# EasyEDA Pro project ProPrj_STC电磁2.0挖孔.epro, schematic Schematic1

## Sheets
1 P1: Board Name: Board1; Create Date: 2025-11-08; Page Name: P1; Project Name: 电磁定制——陈; Schematic Name: Schematic1; Update Date: 2025-11-08; Company: 嘉立创EDA; Page Size: A4; Version: V1.0
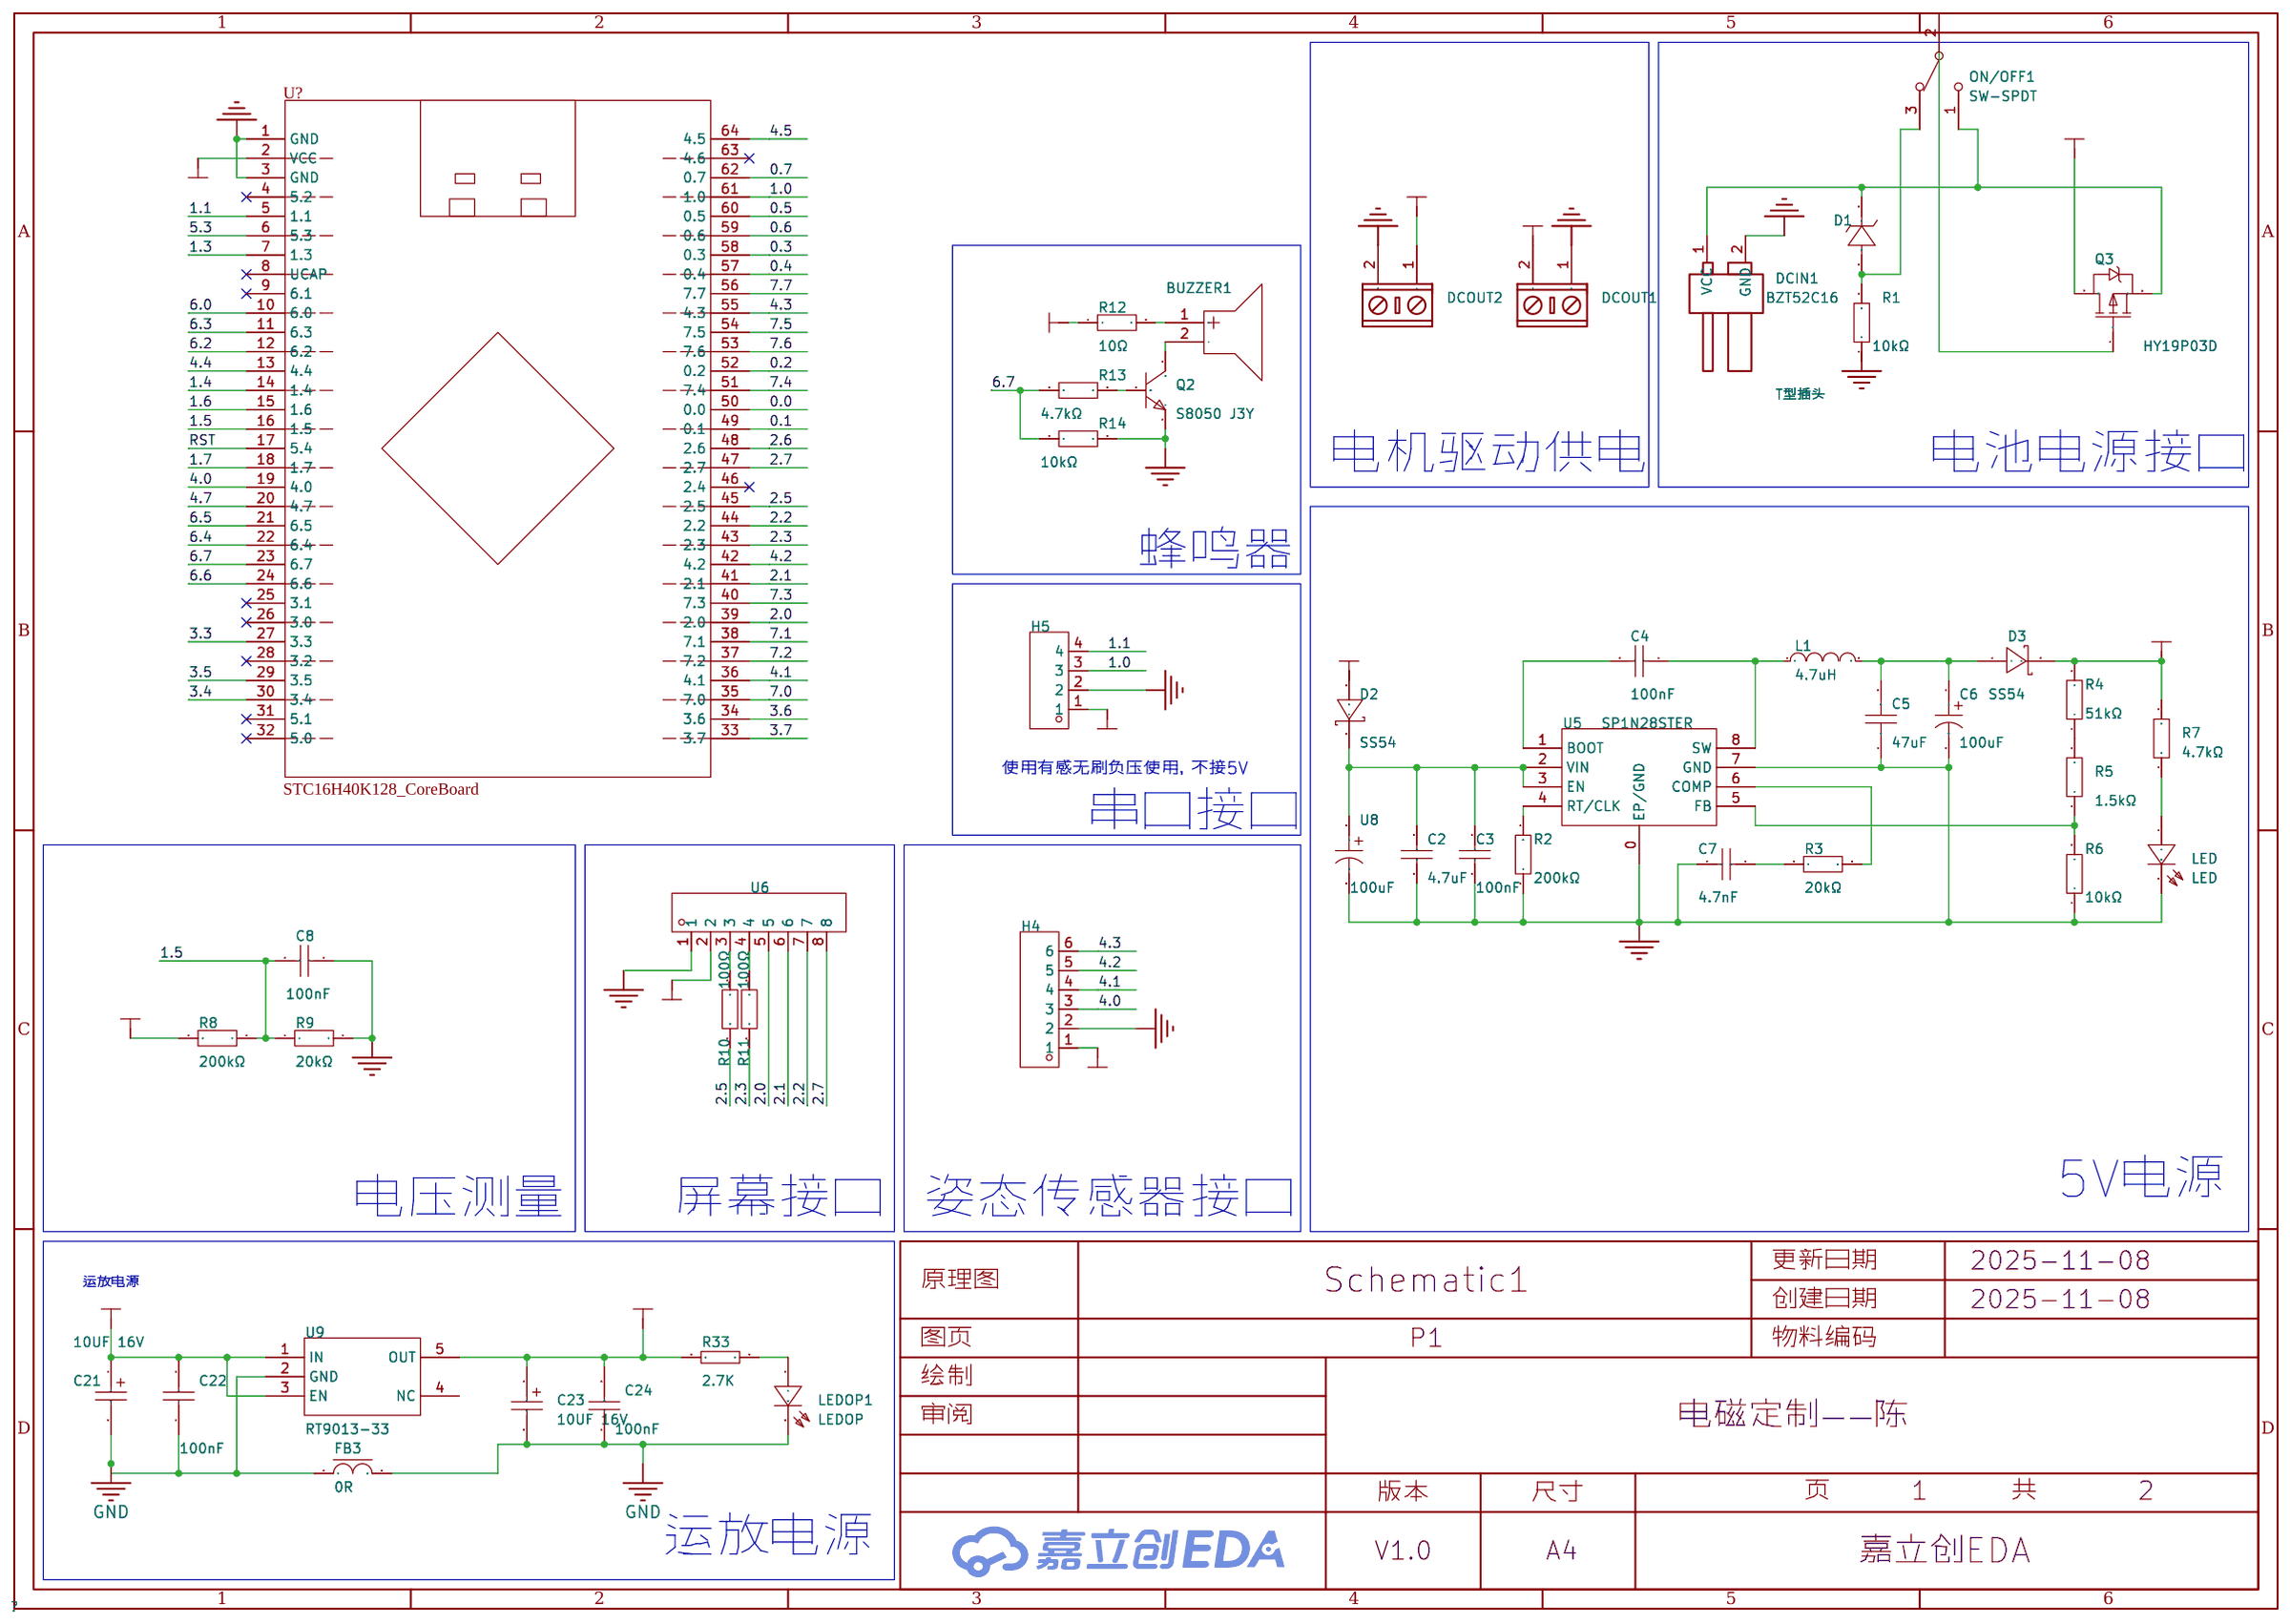
[diagram p0: P1]
2 P2: Page Name: P2
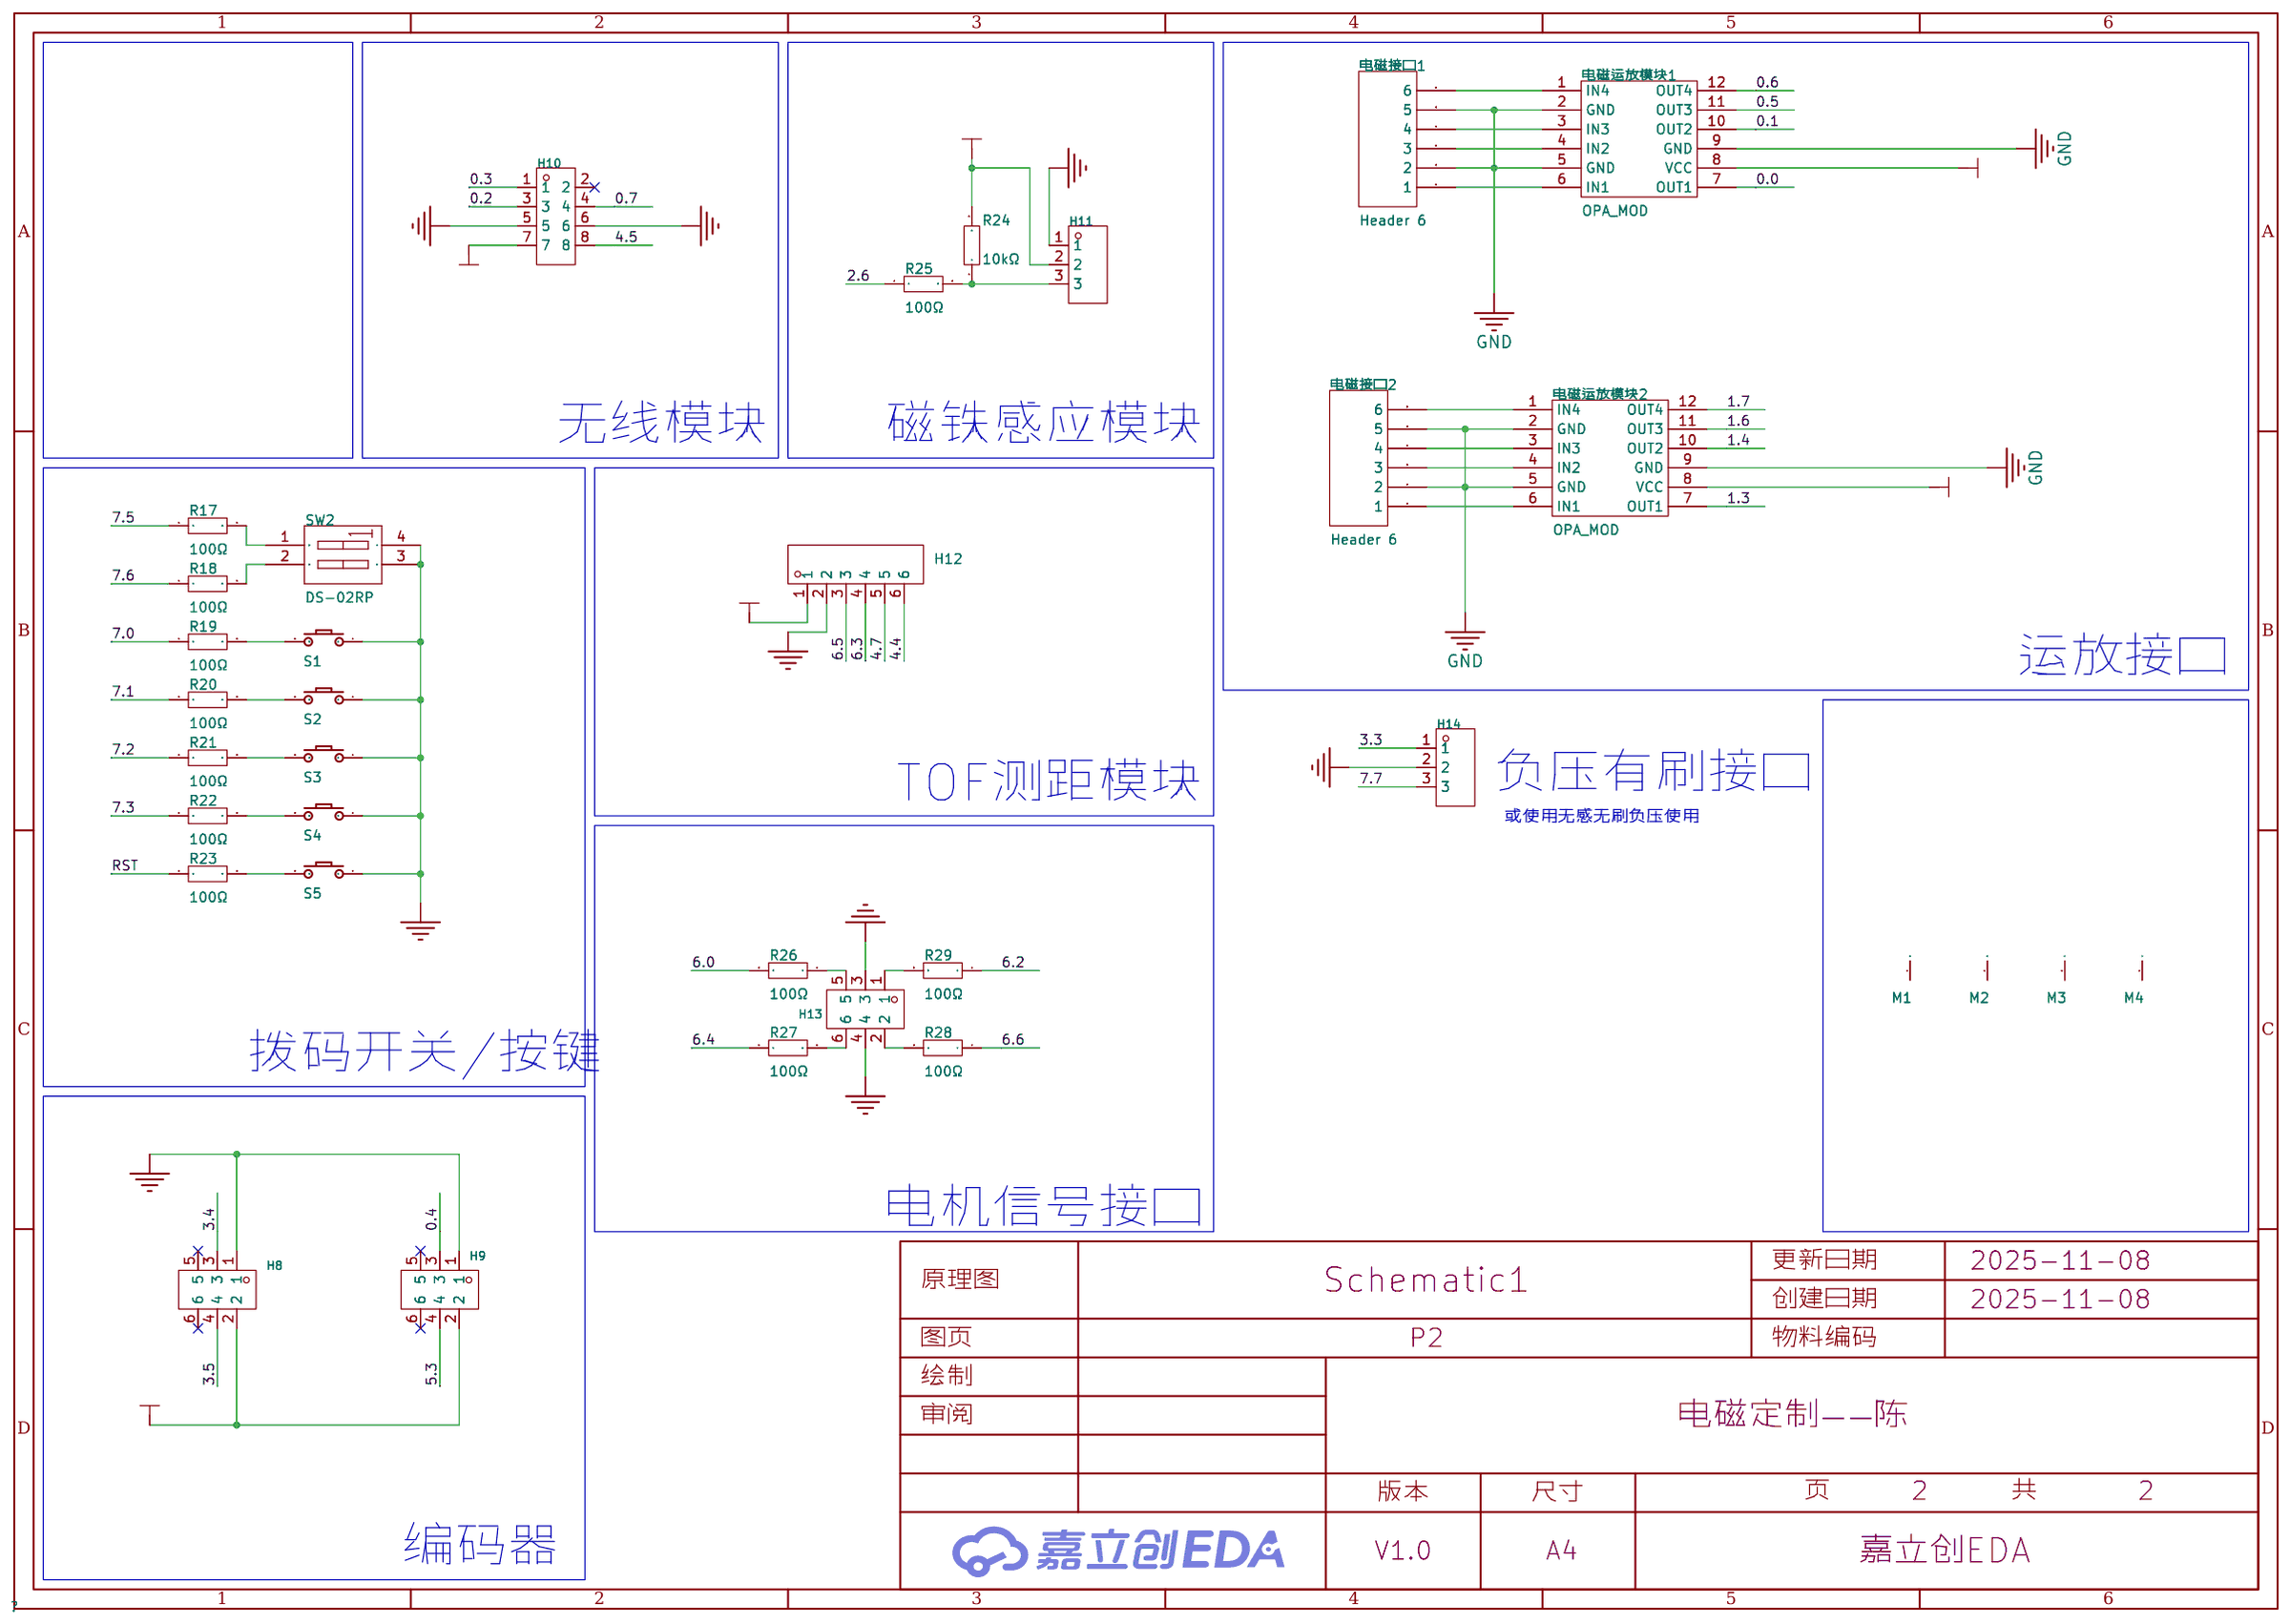
[diagram p1: P2]

## Parts
sheet P1
BUZZER1  2.7kHz  [BUZ-TH_BD9.0-P4.00-D0.6-FD]
C2  4.7uF  [C1206]
C3  100nF  [C0603]
C4  100nF  [C0603]
C5  47uF  [C1206]
C6  100uF  [CAP-SMD_BD6.3-L6.6-W6.6-LS7.6-FD-1]
C7  4.7nF  [C0603]
C8  100nF  [C0603]
C21  10uF  [CAPT3216]
C22  100nF  [CAPC1608[0603]S-N]
C23  10uF  [CAPT3216]
C24  100nF  [CAPC1608[0603]S-N]
D1  BZT52C16  [SOD-123_L2.7-W1.7-LS3.8-RD]
D2  SS54  [SMA_L4.4-W2.8-LS5.4-R-RD]
D3  SS54  [SMA_L4.4-W2.8-LS5.4-R-RD]
DCIN1  T型插头  [Wired T-Header ThroughHole]
DCOUT1  KF/WJ/DG 30x connecter  [KF/WJ/DG 301-2p-5.0mm]
DCOUT2  KF/WJ/DG 30x connecter  [KF/WJ/DG 301-2p-5.0mm]
FB3  0R  [INDC2012[0805]S]
H4  PZ254V-11-06P  [HDR-TH_6P-P2.54-V-M]
H5  PZ254V-11-04P  [HDR-TH_4P-P2.54-V-M]
L1  4.7uH  [IND-SMD_L7.3-W6.6_MHCI06030]
LED  LED  [LEDC1608(0603)]
LEDOP1  LEDOP  [LEDC1608(0603)]
ON/OFF1  SW-SPDT  [SS12D10]
Q2  S8050 J3Y  [SOT-23-3_L3.0-W1.7-P0.95-LS2.9-BR]
Q3  HY19P03D  [TO-252-2_L6.6-W6.1-P4.57-LS9.9-TL-CW]
R1  10kΩ  [R0603]
R2  200kΩ  [R0603]
R3  20kΩ  [R0603]
R4  51kΩ  [R0603]
R5  1.5kΩ  [R0603]
R6  10kΩ  [R0603]
R7  4.7kΩ  [R0603]
R8  200kΩ  [R0603]
R9  20kΩ  [R0603]
R10  100Ω  [R0603]
R11  100Ω  [R0603]
R12  10Ω  [R0603]
R13  4.7kΩ  [R0603]
R14  10kΩ  [R0603]
R33  4.7K  [RESC1608[0603]S-N]
U1  -  [STC32]
U5  SP1N28STER  [SP1N28STER]
U6  PM254-1-08-Z-8.5  [HDR-TH_8P-P2.54-V-F]
U8  100uF  [CAP-SMD_BD6.3-L6.6-W6.6-LS7.6-RD]
U9  RT9013-33  [SOT-23-5]
sheet P2
H8  PZ254V-12-6P  [HDR-TH_6P-P2.54-V-M-R2-C3-S2.54]
H9  PZ254V-12-6P  [HDR-TH_6P-P2.54-V-M-R2-C3-S2.54]
H10  PZ254V-12-8P  [HDR-TH_8P-P2.54-V-M-R2-C4-S2.54]
H11  PZ254V-11-03P  [HDR-TH_3P-P2.54-V-M]
H12  PZ254V-11-06P  [HDR-TH_6P-P2.54-V-M]
H13  PZ254V-12-6P  [HDR-TH_6P-P2.54-V-M-R2-C3-S2.54]
H14  PZ254V-11-03P  [HDR-TH_3P-P2.54-V-M]
M1  MountHole  [M3-MountHole-Plated-D6]
M2  MountHole  [M3-MountHole-Plated-D6]
M3  MountHole  [M3-MountHole-Plated-D6]
M4  MountHole  [M3-MountHole-Plated-D6]
R17  100Ω  [R0603]
R18  100Ω  [R0603]
R19  100Ω  [R0603]
R20  100Ω  [R0603]
R21  100Ω  [R0603]
R22  100Ω  [R0603]
R23  100Ω  [R0603]
R24  10kΩ  [R0603]
R25  100Ω  [R0603]
R26  100Ω  [R0603]
R27  100Ω  [R0603]
R28  100Ω  [R0603]
R29  100Ω  [R0603]
S1  Button  [PTS810-3*4-CurvePin]
S2  Button  [PTS810-3*4-CurvePin]
S3  Button  [PTS810-3*4-CurvePin]
S4  Button  [PTS810-3*4-CurvePin]
S5  Button  [PTS810-3*4-CurvePin]
SW2  DS-02RP  [SW-TH_DS-02XP]
电磁接口1  Header 6  [HDR1X6]
电磁接口2  Header 6  [HDR1X6]
电磁运放模块1  OPA_MOD  [SEEKFREE_4CHANEL_OPAMOD]
电磁运放模块2  OPA_MOD  [SEEKFREE_4CHANEL_OPAMOD]

## Library data of the parts
BUZZER1 = YS-MBZ9042C05R42: 驱动方式:无源(外部驱动);构造类型:电磁式;频率:2.7kHz;声压(SPL):85dB@5V,10cm;; LCSC Part Name: 电磁式无源蜂鸣器5V; Supplier Part: C409837; Manufacturer: Fengming(锋鸣电子); Supplier Footprint: 插件,D=9mm; JLCPCB Part Class: 扩展库; Datasheet: https://atta.szlcsc.com/upload/public/pdf/source/20191217/C409837_893ADB678ED7E25111BC2D1A287FE6B1.pdf; Supplier: LCSC; Oscillator Circuit: 无源(外部驱动); Technology Type: 电磁式; Operating Voltage: 3V~7V; Sound Pressure Level (SPL): 85dB@5V,10cm; Diameter (φD): 9mm; Height: 4.4mm
C2 = 1206B475K500NT: 容值:4.7uF;精度:±10%;额定电压:50V;材质(温度系数):X7R;; LCSC Part Name: 4.7uF ±10% 50V; Supplier Part: C29823; Manufacturer: FH(风华); Supplier Footprint: 1206; JLCPCB Part Class: 基础库; Datasheet: https://atta.szlcsc.com/upload/public/pdf/source/20200305/C486355_26A10D38EF8C2A5C37091D0039909270.pdf; Supplier: LCSC; Tolerance: ±10%; Voltage Rated: 50V; Temperature Coefficient: X7R
C3 C4 C8 = 0603B104K500NT: 容值:100nF;精度:±10%;额定电压:50V;材质(温度系数):X7R;; LCSC Part Name: 100nF ±10% 50V; Supplier Part: C30926; Manufacturer: FH(风华); Supplier Footprint: 0603; JLCPCB Part Class: Extended Part; Datasheet: https://atta.szlcsc.com/upload/public/pdf/source/20200305/C486355_26A10D38EF8C2A5C37091D0039909270.pdf; Supplier: LCSC; Tolerance: ±10%; Voltage Rated: 50V; Temperature Coefficient: X7R
C5 = GRM31CR61E476ME44L: 容值:47uF;精度:±20%;额定电压:25V;材质(温度系数):X5R;; LCSC Part Name: 47uF ±20% 25V; Supplier Part: C403725; Manufacturer: muRata(村田); Supplier Footprint: 1206; JLCPCB Part Class: 扩展库; Datasheet: https://atta.szlcsc.com/upload/public/pdf/source/20191025/C403725_B8A8CD2FFA1F57E6FDF268BD106459D5.pdf; Supplier: LCSC; Tolerance: ±20%; Voltage Rated: 25V; Temperature Coefficient: X5R
C6 = RVE100UF35V67RV0072: 容值:100uF;精度:±20%;额定电压:35V;纹波电流:230mA@120Hz;等效串联电阻:600mΩ@100kHz;; LCSC Part Name: 100uF ±20% 35V; Supplier Part: C2836437; Manufacturer: KNSCHA(科尼盛); Supplier Footprint: SMD,D6.3xL7.7mm; JLCPCB Part Class: 扩展库; Datasheet: https://atta.szlcsc.com/upload/public/pdf/source/20220719/B52EB46F8A1558448ED03D8B4CB3C24F.pdf; Supplier: LCSC; Tolerance: ±20%; Rated Voltage: 35V; Ripple Current: 230mA@120Hz; Equivalent Series Resistance(ESR): 600mΩ@100kHz; φD: 6.3mm; L: 7.7mm; Lifetime @ Temp: 2000hrs@105℃; Operating Temperature: -55℃~+105℃
C7 = 0603B472K500NT: 容值:4.7nF;精度:±10%;额定电压:50V;材质(温度系数):X7R;; LCSC Part Name: 4.7nF ±10% 50V; Supplier Part: C53987; Manufacturer: FH(风华); Supplier Footprint: 0603; JLCPCB Part Class: Basic Part; Datasheet: https://atta.szlcsc.com/upload/public/pdf/source/20200305/C486355_26A10D38EF8C2A5C37091D0039909270.pdf; Supplier: LCSC; Tolerance: ±10%; Voltage Rated: 50V; Temperature Coefficient: X7R
C21 C23 = Cap-Tan: Published: 8-Jun-2000; Revision: July-2002: Re-released for DXP Platform.; Publisher: Altium Limited; Price(RMB): 0.000; Voltage: 16V; Origin Footprint 2: CAPT3528; Origin Footprint 3: CAPT6032; Origin Footprint 4: CAPT7343; Origin Footprint 5: CAPT7361
C22 C24 = Cap-Chip: Published: 2020-12-18; Revision: V1.1; Voltage: 50V; Tolerance: ±10%; Origin Footprint 2: CAPC1310[0504]S; Origin Footprint 3: CAPC3216[1206]S; Origin Footprint 4: CAPC3225[1210]S; Origin Footprint 5: CAPC4532[1812]S; Origin Footprint 6: CAPC4564[1825]S; Origin Footprint 7: CAPC2012[0805]; Origin Footprint 8: CAPC3216[1206]; Origin Footprint 9: CAPC3225[1210]; Origin Footprint 10: CAPC4532[1812]; Origin Footprint 11: CAPC4564[1825]; Origin Footprint 12: CAPC1608[0603]-N; Origin Footprint 13: CAPC1608[0603]-L; Origin Footprint 14: CAPC1608[0603]-M; Origin Footprint 15: CAPC1608[0603]S-L; Origin Footprint 16: CAPC1608[0603]S-M; Origin Footprint 17: CAPC1005[0402]-L; Origin Footprint 18: CAPC1005[0402]-M; Origin Footprint 19: CAPC1005[0402]-N; Origin Footprint 20: CAPC1005[0402]S-L; Origin Footprint 21: CAPC1005[0402]S-M; Origin Footprint 22: CAPC1005[0402]S-N; Origin Footprint 23: CAPC2012[0805]S-L; Origin Footprint 24: CAPC2012[0805]S-M; Origin Footprint 25: CAPC2012[0805]S-N
D1 = BZT52C16_C727007: 二极管配置:独立式;稳压值(标称值):16V;稳压值(范围):15.3V~17.1V;功率:500mW;精度:-;; Supplier Part: C727007; Manufacturer: TWGMC(台湾迪嘉); Supplier Footprint: SOD-123; JLCPCB Part Class: 扩展库; Datasheet: https://atta.szlcsc.com/upload/public/pdf/source/20200828/C727006_A23CB424A23C0F54CFF10A724B844049.pdf; Supplier: LCSC; Diode Configuration: 独立式; Zener Voltage (Nom): 16V; Reverse Leakage Current (Ir): 100nA@11.2V; Zener Voltage (Range): 15.3V~17.1V; Power Dissipation: 500mW; Zener Impedance (Zzt): 40Ω
D2 D3 = SS54_C22452: 正向压降(Vf):550mV@5A;直流反向耐压(Vr):40V;平均整流电流(Io):5A;; LCSC Part Name: 电压:40V 电流:5A; Supplier Part: C22452; Manufacturer: MDD; Supplier Footprint: SMA(DO-214AC); JLCPCB Part Class: 基础库; Datasheet: https://atta.szlcsc.com/upload/public/pdf/source/20230314/529CD85F9B31F69841D3A079BC07E377.pdf; Supplier: LCSC; Forward Voltage (Vf@If): 550mV@5A; Reverse Voltage (Vr): 40V; Average Rectified Current (Io): 5A; Reverse Leakage Current (Ir): 1mA@40V
DCIN1 = T_Header: Library Name: TC264_主板_V2.6
DCOUT1 DCOUT2 = KF/WJ/DG 30x: 接线端子 2Pin; Library Name: TC264_主板_V2.6
FB3 = Ind-Chip: Published: 2020-12-18; Revision: V1.0; Imax: 500mA; DCR: .1m; Origin Footprint 2: INDC1608[0603]S; Origin Footprint 3: INDC3216[1206]S; Origin Footprint 4: INDC4509[1806]S; Origin Footprint 5: INDC1005[0402]; Origin Footprint 6: INDC1608[0603]; Origin Footprint 7: INDC2012[0805]; Origin Footprint 8: INDC3216[1206]; Origin Footprint 9: INDC3225[1210]; Origin Footprint 10: INDC3216[1206]
H4 H12 = PZ254V-11-06P: 插针结构:1x6P;间距:2.54mm;行距:-;圆针/方针:方针;安装类型:直插;排数:单排;总PIN位数:6P;额定电流:-;额定电压:-;配合针长度:6mm;塑高:2.5mm;端接针长度:3mm;触头材质:黄铜;触头镀层:-;工作温度范围:-40℃~+105℃;颜色:黑色;; LCSC Part Name: 间距:2.54mm 1x6P 直插 方针; Supplier Part: C492405; Manufacturer: XFCN(兴飞); Supplier Footprint: 插件,P=2.54mm; JLCPCB Part Class: Extended Part; Datasheet: https://atta.szlcsc.com/upload/public/pdf/source/20200309/C492405_597F1930F5B55CC3C7FD95458F1C3977.pdf; Supplier: LCSC; Pin Structure: 1x6P; Pitch: 2.54mm; Circluar Pins/Square Pins: 方针; Mounting Type: 直插; Number of Rows: 单排; Number of Pins: 6P; Length of Mating Pin: 6mm; Insulation Height: 2.5mm; Length of End Connection Pin: 3mm; Contact Material: 黄铜; Operating Temperature Range: -40℃~+105℃; Color: 黑色
H5 = PZ254V-11-04P: 插针结构:1x4P;间距:2.54mm;行距:-;圆针/方针:方针;安装类型:直插;排数:单排;总PIN位数:4P;额定电流:3A;额定电压:250V;配合针长度:6mm;塑高:2.5mm;端接针长度:3mm;触头材质:-;工作温度范围:-40℃~+105℃;颜色:黑色;; LCSC Part Name: 间距:2.54mm 1x4P 直插 方针; Supplier Part: C2691448; Manufacturer: XFCN(兴飞); Supplier Footprint: 插件,P=2.54mm; JLCPCB Part Class: 扩展库; Datasheet: https://atta.szlcsc.com/upload/public/pdf/source/20200309/C492403_F9F19131791D08044AD4F84F8E751A34.pdf; Supplier: LCSC; Pin Structure: 1x4P; Pitch: 2.54mm; Circluar Pins/Square Pins: 方针; Mounting Type: 直插; Number of Rows: 单排; Number of Pins: 4P; Current Rating (Max): 3A; Voltage Rating (Max): 250V; Length of Mating Pin: 6mm; Insulation Height: 2.5mm; Length of End Connection Pin: 3mm; Operating Temperature Range: -40℃~+105℃; Color: 黑色
L1 = TMPC0605H-2R2MG-D: 电感值:2.2uH;精度:±20%;额定电流:10A;饱和电流(Isat):14A;; LCSC Part Name: 2.2uH ±20% 14A; Supplier Part: C357209; Manufacturer: TAI-TECH(台庆); Supplier Footprint: SMD; JLCPCB Part Class: 扩展库; Datasheet: https://atta.szlcsc.com/upload/public/pdf/source/20200917/C357209_5D3CAA6BD457DA578E1A24064CC10AD0.pdf; Supplier: LCSC; Tolerance: ±20%; Rated Current: 10A; Saturation Current (Isat): 14A; DC Resistance (DCR): 11.2mΩ
LED LEDOP1 = LED Chip Green: Published: 8-Jun-2000; Revision: July-2002: Re-released for DXP Platform.; Publisher: Altium Limited; Price(RMB): 0.00; Origin Footprint 2: LEDC2012(0805); Origin Footprint 3: LEDC3216(1206); Origin Footprint 4: LEDC1608(0603)-L; Origin Footprint 5: LEDC2012(0805)-L; Origin Footprint 6: LEDC3216(1204); Origin Footprint 7: LEDC3528-2
ON/OFF1 = SW-SPDT: Published: 24-Mar-1999; Publisher: Altium Limited; Price(RMB): 0.000; Origin Footprint 2: ToggleSwitch 7102; Origin Footprint 3: SS12D06; Origin Footprint 4: SS12D07VG4; Origin Footprint 5: MSK-12C02
Q2 = S8050 J3Y_C2146: 晶体管类型:NPN;集电极电流(Ic):500mA;集射极击穿电压(Vceo):25V;功率(Pd):300mW;直流电流增益(hFE@Ic,Vce):200@50mA,1V;; LCSC Part Name: NPN 电流:500mA 耐压:25V H档(200-350); Supplier Part: C2146; Manufacturer: CJ(江苏长电/长晶); Supplier Footprint: SOT-23; JLCPCB Part Class: 基础库; Datasheet: https://atta.szlcsc.com/upload/public/pdf/source/20140809/1457707209234.pdf; Supplier: LCSC; Transistor Type: NPN; Collector Current (Ic): 500mA; Collector-Emitter Breakdown Voltage (Vceo): 25V; Power Dissipation (Pd): 300mW; DC Current Gain (hFE@Ic,Vce): 200@50mA,1V; Transition Frequency (fT): 150MHz; Collector Cut-Off Current (Icbo): 100nA; Collector-Emitter Saturation Voltage (VCE(sat)@Ic,Ib): 600mV@500mA,50mA
Q3 = HY19P03D: 类型:P沟道;漏源电压(Vdss):30V;连续漏极电流(Id):90A;功率(Pd):50W;导通电阻(RDS(on)@Vgs,Id):6mΩ@10V,45A;阈值电压(Vgs(th)@Id):3V@250uA;; LCSC Part Name: P沟道 耐压:30V 电流:90A; Supplier Part: C122492; Manufacturer: HUAYI(华羿微); Supplier Footprint: TO-252-2; JLCPCB Part Class: 扩展库; Datasheet: https://atta.szlcsc.com/upload/public/pdf/source/20170728/C122492_1501225751911848809.pdf; Supplier: LCSC; Type: P沟道; Drain Source Voltage (Vdss): 30V; Continuous Drain Current (Id): 90A; Power Dissipation (Pd): 50W; Drain Source On Resistance (RDS(on)@Vgs,Id): 6mΩ@10V,45A; Gate Threshold Voltage (Vgs(th)@Id): 3V@250uA
R1 R6 R14 R24 = 0603WAF1002T5E: 电阻类型:厚膜电阻;阻值:10kΩ;精度:±1%;功率:100mW;最大工作电压:75V;温度系数:±100ppm/℃;; LCSC Part Name: 厚膜电阻 10kΩ ±1% 100mW; Supplier Part: C25804; Manufacturer: UNI-ROYAL(厚声); Supplier Footprint: 0603; JLCPCB Part Class: 基础库; Datasheet: https://atta.szlcsc.com/upload/public/pdf/source/20200306/C422600_1E6D84923E4A46A82E41ADD87F860B5C.pdf; Supplier: LCSC; Type: 厚膜电阻; Tolerance: ±1%; Power(Watts): 100mW; Overload Voltage (Max): 75V; Temperature Coefficient: ±100ppm/℃; Operating Temperature Range: -55℃~+155℃
R2 R8 = 0603WAF2003T5E: 电阻类型:厚膜电阻;阻值:200kΩ;精度:±1%;功率:100mW;最大工作电压:75V;温度系数:±100ppm/℃;; LCSC Part Name: 200kΩ ±1% 100mW 厚膜电阻; Supplier Part: C25811; Manufacturer: UNI-ROYAL(厚声); Supplier Footprint: 0603; JLCPCB Part Class: Basic Part; Datasheet: https://atta.szlcsc.com/upload/public/pdf/source/20200306/C422600_1E6D84923E4A46A82E41ADD87F860B5C.pdf; Supplier: LCSC; Type: 厚膜电阻; Tolerance: ±1%; Power(Watts): 100mW; Overload Voltage (Max): 75V; Temperature Coefficient: ±100ppm/℃; Operating Temperature Range: -55℃~+155℃
R3 R9 = 0603WAF2002T5E: 电阻类型:厚膜电阻;阻值:20kΩ;精度:±1%;功率:100mW;最大工作电压:75V;温度系数:±100ppm/℃;; LCSC Part Name: 20kΩ ±1% 100mW 厚膜电阻; Supplier Part: C4184; Manufacturer: UNI-ROYAL(厚声); Supplier Footprint: 0603; JLCPCB Part Class: Basic Part; Datasheet: https://atta.szlcsc.com/upload/public/pdf/source/20200306/C422600_1E6D84923E4A46A82E41ADD87F860B5C.pdf; Supplier: LCSC; Type: 厚膜电阻; Tolerance: ±1%; Power(Watts): 100mW; Overload Voltage (Max): 75V; Temperature Coefficient: ±100ppm/℃; Operating Temperature Range: -55℃~+155℃
R4 = 0603WAF5102T5E: 电阻类型:厚膜电阻;阻值:51kΩ;精度:±1%;功率:100mW;最大工作电压:75V;温度系数:±100ppm/℃;; LCSC Part Name: 51kΩ ±1% 100mW 厚膜电阻; Supplier Part: C23196; Manufacturer: UNI-ROYAL(厚声); Supplier Footprint: 0603; JLCPCB Part Class: Basic Part; Datasheet: https://atta.szlcsc.com/upload/public/pdf/source/20200306/C422600_1E6D84923E4A46A82E41ADD87F860B5C.pdf; Supplier: LCSC; Type: 厚膜电阻; Tolerance: ±1%; Power(Watts): 100mW; Overload Voltage (Max): 75V; Temperature Coefficient: ±100ppm/℃; Operating Temperature Range: -55℃~+155℃
R5 = 0603WAF1501T5E: 电阻类型:厚膜电阻;阻值:1.5kΩ;精度:±1%;功率:100mW;最大工作电压:75V;温度系数:±100ppm/℃;; LCSC Part Name: 1.5kΩ ±1% 100mW 厚膜电阻; Supplier Part: C22843; Manufacturer: UNI-ROYAL(厚声); Supplier Footprint: 0603; JLCPCB Part Class: Basic Part; Datasheet: https://atta.szlcsc.com/upload/public/pdf/source/20200306/C422600_1E6D84923E4A46A82E41ADD87F860B5C.pdf; Supplier: LCSC; Type: 厚膜电阻; Tolerance: ±1%; Power(Watts): 100mW; Overload Voltage (Max): 75V; Temperature Coefficient: ±100ppm/℃; Operating Temperature Range: -55℃~+155℃
R7 R13 = 0603WAF4701T5E: 电阻类型:厚膜电阻;阻值:4.7kΩ;精度:±1%;功率:100mW;最大工作电压:75V;温度系数:±100ppm/℃;; LCSC Part Name: 4.7kΩ ±1% 100mW 厚膜电阻; Supplier Part: C23162; Manufacturer: UNI-ROYAL(厚声); Supplier Footprint: 0603; JLCPCB Part Class: Basic Part; Datasheet: https://atta.szlcsc.com/upload/public/pdf/source/20200306/C422600_1E6D84923E4A46A82E41ADD87F860B5C.pdf; Supplier: LCSC; Type: 厚膜电阻; Tolerance: ±1%; Power(Watts): 100mW; Overload Voltage (Max): 75V; Temperature Coefficient: ±100ppm/℃; Operating Temperature Range: -55℃~+155℃
R10 R11 R17-R23 R25-R29 = RC0603FR-07100RL: 电阻类型:厚膜电阻;阻值:100Ω;精度:±1%;功率:100mW;最大工作电压:75V;温度系数:±100ppm/℃;; LCSC Part Name: 厚膜电阻 100Ω ±1% 100mW; Supplier Part: C105588; Manufacturer: YAGEO(国巨); Supplier Footprint: 0603; JLCPCB Part Class: Extended Part; Datasheet: https://atta.szlcsc.com/upload/public/pdf/source/20180316/70C0E2BDAE7FCC62C531A5A58D202EE1.pdf; Supplier: LCSC; Type: 厚膜电阻; Tolerance: ±1%; Power(Watts): 100mW; Overload Voltage (Max): 75V; Temperature Coefficient: ±100ppm/℃; Operating Temperature Range: -55℃~+155℃
R12 = 0603WAF100JT5E: 电阻类型:厚膜电阻;阻值:10Ω;精度:±1%;功率:100mW;最大工作电压:75V;温度系数:±400ppm/℃;; LCSC Part Name: 10Ω ±1% 100mW 厚膜电阻; Supplier Part: C22859; Manufacturer: UNI-ROYAL(厚声); Supplier Footprint: 0603; JLCPCB Part Class: 基础库; Datasheet: https://atta.szlcsc.com/upload/public/pdf/source/20200306/C422600_1E6D84923E4A46A82E41ADD87F860B5C.pdf; Supplier: LCSC; Type: 厚膜电阻; Tolerance: ±1%; Power(Watts): 100mW; Overload Voltage (Max): 75V; Temperature Coefficient: ±400ppm/℃; Operating Temperature Range: -55℃~+155℃
R33 = Res-Chip_4: Published: 8-Jun-2000; Revision: July-2002: Re-released for DXP Platform.; Tolerance: ±1%; Origin Footprint 2: RESC3225[1210]S; Origin Footprint 3: RESC5025[2010]S; Origin Footprint 4: RESC6332[2512]S; Origin Footprint 5: RESC5025[2010]; Origin Footprint 6: RESC6332[2512]; Origin Footprint 7: RESC3225[1210]; Origin Footprint 8: RESC3216[1206]; Origin Footprint 9: RESC2012[0805]; Origin Footprint 10: RESC1608[0603]-M; Origin Footprint 11: RESC1608[0603]-L; Origin Footprint 12: RESC1608[0603]-N; Origin Footprint 13: RESC1608[0603]S-L; Origin Footprint 14: RESC1608[0603]S-M; Origin Footprint 15: RESC1005[0402]-L; Origin Footprint 16: RESC1005[0402]-N; Origin Footprint 17: RESC1005[0402]-M; Origin Footprint 18: RESC1005[0402]S-L; Origin Footprint 19: RESC1005[0402]S-M; Origin Footprint 20: RESC1005[0402]S-N; Origin Footprint 21: RESC2012[0805]S-L; Origin Footprint 22: RESC2012[0805]S-M; Origin Footprint 23: RESC2012[0805]S-N; Origin Footprint 24: RESC3216[1206]S-L; Origin Footprint 25: RESC3216[1206]S-M; Origin Footprint 26: RESC3216[1206]S-N
U1 = stc32
U5 = SP1N28STER: Revision: V1.0
U6 = PM254-1-08-Z-8.5: 插孔结构:1x8P;间距:2.54mm;行距:-;圆孔/方孔:方孔;安装类型:直插;排数:单排;总孔位数:8P;额定电流:3A;额定电压:-;插孔方向:顶部;塑高:8.5mm;工作温度范围:-40℃~+105℃;; LCSC Part Name: 间距:2.54mm 1x8P 直插; Supplier Part: C2897371; Manufacturer: HCTL(华灿天禄); Supplier Footprint: 插件,P=2.54mm; JLCPCB Part Class: Extended Part; Datasheet: https://atta.szlcsc.com/upload/public/pdf/source/20230609/534BE42964C679BDE98E061007C4ABD6.pdf; Supplier: LCSC; Holes Structure: 1x8P; Pitch: 2.54mm; Circular Hole / Square Hole: 方孔; Mounting Type: 直插; Number of Rows: 单排; Number of Holes: 8P; Current Rating (Max): 3A; Holes Direction: 顶部; Insulation Height: 8.5mm; Operating Temperature Range: -40℃~+105℃
U8 = RVT1H101M0607: 容值:100uF;精度:±20%;额定电压:50V;纹波电流:229mA@120Hz;; LCSC Part Name: 100uF ±20% 50V; Supplier Part: C3151829; Manufacturer: ROQANG(容强); Supplier Footprint: SMD,D6.3xL7.7mm; JLCPCB Part Class: 扩展库; Datasheet: https://atta.szlcsc.com/upload/public/pdf/source/20170325/1490427950282.pdf; Supplier: LCSC; Tolerance: ±20%; Rated Voltage: 50V; Ripple Current: 229mA@120Hz; φD: 6.3mm; L: 7.7mm; Lifetime @ Temp: 2000hrs@105℃; Operating Temperature: -40℃~+105℃
U9 = RT9013-33
H8 H9 H13 = PZ254V-12-6P: 插针结构:2x3P;间距:2.54mm;行距:2.54mm;圆针/方针:方针;安装类型:直插;排数:双排;总PIN位数:6P;额定电流:-;额定电压:-;配合针长度:6mm;塑高:2.5mm;端接针长度:3mm;触头材质:黄铜;触头镀层:-;工作温度范围:-40℃~+105℃;颜色:黑色;; LCSC Part Name: 间距:2.54mm 2x3P 直插 方针; Supplier Part: C492420; Manufacturer: XFCN(兴飞); Supplier Footprint: 插件,P=2.54mm; JLCPCB Part Class: Extended Part; Datasheet: https://atta.szlcsc.com/upload/public/pdf/source/20200309/C492420_BAECB307B001054C09D200388220EAE6.pdf; Supplier: LCSC; Pin Structure: 2x3P; Pitch: 2.54mm; Row Spacing: 2.54mm; Circluar Pins/Square Pins: 方针; Mounting Type: 直插; Number of Rows: 双排; Number of Pins: 6P; Length of Mating Pin: 6mm; Insulation Height: 2.5mm; Length of End Connection Pin: 3mm; Contact Material: 黄铜; Operating Temperature Range: -40℃~+105℃; Color: 黑色
H10 = PZ254V-12-8P: 插针结构:2x4P;间距:2.54mm;行距:2.54mm;圆针/方针:方针;安装类型:直插;排数:双排;总PIN位数:8P;额定电流:-;额定电压:-;配合针长度:6mm;塑高:2.5mm;端接针长度:3mm;触头材质:黄铜;触头镀层:-;工作温度范围:-40℃~+105℃;颜色:黑色;; LCSC Part Name: 间距:2.54mm 2x4P 直插 方针; Supplier Part: C492421; Manufacturer: XFCN(兴飞); Supplier Footprint: 插件,P=2.54mm; JLCPCB Part Class: Extended Part; Datasheet: https://atta.szlcsc.com/upload/public/pdf/source/20200309/C492421_DC8A206AF99CD7755BD4A5B0BC48200B.pdf; Supplier: LCSC; Pin Structure: 2x4P; Pitch: 2.54mm; Row Spacing: 2.54mm; Circluar Pins/Square Pins: 方针; Mounting Type: 直插; Number of Rows: 双排; Number of Pins: 8P; Length of Mating Pin: 6mm; Insulation Height: 2.5mm; Length of End Connection Pin: 3mm; Contact Material: 黄铜; Operating Temperature Range: -40℃~+105℃; Color: 黑色
H11 H14 = PZ254V-11-03P: 插针结构:1x3P;间距:2.54mm;行距:-;圆针/方针:方针;安装类型:直插;排数:单排;总PIN位数:3P;额定电流:3A;额定电压:250V;配合针长度:6mm;塑高:2.5mm;端接针长度:3mm;工作温度范围:-40℃~+105℃;颜色:黑色;; LCSC Part Name: 间距:2.54mm 1x3P 直插 方针; Supplier Part: C2937625; Manufacturer: XFCN(兴飞); Supplier Footprint: 插件,P=2.54mm; JLCPCB Part Class: Extended Part; Datasheet: https://atta.szlcsc.com/upload/public/pdf/source/20200309/C492402_8335C3D49C4E4C618838D59BB1D024C1.pdf; Supplier: LCSC; Pin Structure: 1x3P; Pitch: 2.54mm; Circluar Pins/Square Pins: 方针; Mounting Type: 直插; Number of Rows: 单排; Number of Pins: 3P; Current Rating (Max): 3A; Voltage Rating (Max): 250V; Length of Mating Pin: 6mm; Insulation Height: 2.5mm; Length of End Connection Pin: 3mm; Operating Temperature Range: -40℃~+105℃; Color: 黑色
M1-M4 = MountHole: 固定孔; Library Name: TC264_主板_V2.6
S1-S5 = KEY: 按键; Published: 24-Mar-1999; Publisher: Altium Limited; Price(RMB): 0.000; Library Name: TC264_主板_V2.6
SW2 = DS-02RP: 类型:平拨,凸起式;电路结构:单刀单掷;开关位数:2位;额定电流:25mA;额定电压:24V;使用寿命:3千次;颜色:红色;; LCSC Part Name: 间距2.54mm 平拨,凸起式 2位拨码开关; Supplier Part: C92646; Manufacturer: 韩国韩荣; Supplier Footprint: 插件; JLCPCB Part Class: 扩展库; Datasheet: https://atta.szlcsc.com/upload/public/pdf/source/20210810/ECF2F28B1CE673E7F9581E27682BDB10.pdf; Supplier: LCSC; Type: 平拨,凸起式; Circuit: 单刀单掷; Number of Positions: 2位; Lead Pitch: 2.54mm; Current Rating: 25mA; Voltage Rating: 24V; Operating Temperature: -20℃~+70℃; Operating Life: 3千次; Color: 红色
电磁接口1 电磁接口2 = Header 6: LatestRevisionDate: 17-Jul-2002; LatestRevisionNote: Re-released for DXP Platform.; Publisher: Altium Limited; Price(RMB): 0.00; Origin Footprint 2: PH2.0-6; Origin Footprint 3: XH2.54-6; Origin Footprint 4: VH3.96-6; Origin Footprint 5: GH1.25T-6P; Origin Footprint 6: ZH1.5-WF-6P
电磁运放模块1 电磁运放模块2 = OPA_4CHANNEL_SEEKFREE

## Nets
GND: C2.1 C3.1 C5.1 C6.2 C7.1 C8.1 C21.2 C22.1 C23.2 C24.1 DCIN1.2(GND) DCOUT1.1 DCOUT2.2 FB3.1 FB3.2 H4.2 H5.2 H8.1 H9.1 H10.5 H10.6 H11.1 H12.2 H13.3 H13.4 H14.2 LED.C LEDOP1.C Q2.2(E) R1.1 R2.1 R6.1 R9.2 R14.2 S1.1 S2.1 S3.1 S4.1 S5.1 SW2.3 SW2.4 U1.1(GND) U1.3(GND) U5.0(EP/GND) U5.7(GND) U6.1 U8.2 U9.2(GND) 电磁接口1.2 电磁接口1.5 电磁接口2.2 电磁接口2.5 电磁运放模块1.2(GND) 电磁运放模块1.5(GND) 电磁运放模块1.9(GND) 电磁运放模块2.2(GND) 电磁运放模块2.5(GND) 电磁运放模块2.9(GND)
VBAT: D2.1(A) DCOUT1.2 DCOUT2.1 Q3.2(D) R8.2
VCC5V: C21.1 C22.2 D3.2(K) H4.1 H5.1 H8.2 H9.2 H10.7 H11.2 H12.1 R4.2 R7.2 R12.1 R24.2 U1.2(VCC) U6.2 U9.1(IN) U9.3(EN)
VCCOP: C23.1 C24.2 R33.2 U9.5(OUT) 电磁运放模块1.8(VCC) 电磁运放模块2.8(VCC)
0.0: U1.50(0.0) 电磁运放模块1.7(OUT1)
0.1: U1.49(0.1) 电磁运放模块1.10(OUT2)
0.2: H10.3 U1.52(0.2)
0.3: H10.1 U1.58(0.3)
0.4: H9.3 U1.57(0.4)
0.5: U1.60(0.5) 电磁运放模块1.11(OUT3)
0.6: U1.59(0.6) 电磁运放模块1.12(OUT4)
0.7: H10.4 U1.62(0.7)
1.0: H5.3 U1.61(1.0)
1.1: H5.4 U1.5(1.1)
1.3: U1.7(1.3) 电磁运放模块2.7(OUT1)
1.4: U1.14(1.4) 电磁运放模块2.10(OUT2)
1.5: C8.2 R8.1 R9.1 U1.16(1.5)
1.6: U1.15(1.6) 电磁运放模块2.11(OUT3)
1.7: U1.18(1.7) 电磁运放模块2.12(OUT4)
2.0: U1.39(2.0) U6.5
2.1: U1.41(2.1) U6.6
2.2: U1.44(2.2) U6.7
2.3: R11.2 U1.43(2.3)
2.5: R10.2 U1.45(2.5)
2.6: R25.1 U1.48(2.6)
2.7: U1.47(2.7) U6.8
3.3: H14.1 U1.27(3.3)
3.4: H8.3 U1.30(3.4)
3.5: H8.4 U1.29(3.5)
3.6: U1.34(3.6)
3.7: U1.33(3.7)
4.0: H4.3 U1.19(4.0)
4.1: H4.4 U1.36(4.1)
4.2: H4.5 U1.42(4.2)
4.3: H4.6 U1.55(4.3)
4.4: H12.6 U1.13(4.4)
4.5: H10.8 U1.64(4.5)
4.7: H12.5 U1.20(4.7)
5.3: H9.4 U1.6(5.3)
6.0: R26.2 U1.10(6.0)
6.2: R29.1 U1.12(6.2)
6.3: H12.4 U1.11(6.3)
6.4: R27.1 U1.22(6.4)
6.5: H12.3 U1.21(6.5)
6.6: R28.1 U1.24(6.6)
6.7: R13.1 R14.1 U1.23(6.7)
7.0: R19.1 U1.35(7.0)
7.1: R20.1 U1.38(7.1)
7.2: R21.1 U1.37(7.2)
7.3: R22.1 U1.40(7.3)
7.4: U1.51(7.4)
7.5: R17.1 U1.54(7.5)
7.6: R18.1 U1.53(7.6)
7.7: H14.3 U1.56(7.7)
RST: R23.1 U1.17(5.4)
$1N1706: D1.2(A) ON/OFF1.3 R1.2
$1N1715: D1.1(K) DCIN1.1(VCC) ON/OFF1.1 Q3.3(S)
$1N2398: C2.2 C3.2 D2.2(K) U5.2(VIN) U5.3(EN) U8.1
$1N2502: R2.2 U5.4(RT/CLK)
$1N2604: C4.2 U5.1(BOOT)
$1N2682: C4.1 L1.1 U5.8(SW)
$1N3128: R3.2 U5.6(COMP)
$1N3133: C7.2 R3.1
$1N3191: C5.2 C6.1 D3.1(A) L1.2
$1N3383: R4.1 R5.2
$1N3387: R5.1 R6.2 U5.5(FB)
$1N3546: LED.A R7.1
$1N5438: R10.1 U6.3
$1N5441: R11.1 U6.4
$1N6146: BUZZER1.1(+) R12.2
$1N6303: Q2.1(B) R13.2
$1N6306: BUZZER1.2(-) Q2.3(C)
$1N11511: ON/OFF1.2 Q3.1(G)
$1N19309: LEDOP1.A R33.1
$2N739: R17.2 SW2.1(A1)
$2N743: R18.2 SW2.2(A2)
$2N1137: R19.2 S1.2
$2N1140: R20.2 S2.2
$2N1143: R21.2 S3.2
$2N1146: R22.2 S4.2
$2N1149: R23.2 S5.2
$2N1985: H11.3 R24.1 R25.2
$2N2479: H13.1 R29.2
$2N2485: H13.2 R28.2
$2N2491: H13.6 R27.2
$2N2497: H13.5 R26.1
$2N17069: 电磁接口1.6 电磁运放模块1.1(IN4)
$2N17070: 电磁接口1.1 电磁运放模块1.6(IN1)
$2N17080: 电磁接口1.3 电磁运放模块1.4(IN2)
$2N17081: 电磁接口1.4 电磁运放模块1.3(IN3)
$2N17084: 电磁接口2.6 电磁运放模块2.1(IN4)
$2N17085: 电磁接口2.1 电磁运放模块2.6(IN1)
$2N17095: 电磁接口2.3 电磁运放模块2.4(IN2)
$2N17096: 电磁接口2.4 电磁运放模块2.3(IN3)

Not connected (* = marked no-connect by the designer): H8 5* 6*; H9 5* 6*; H10 2*; M1 1; M2 1; M3 1; M4 1; U1 4(5.2)* 8(UCAP)* 9(6.1)* 25(3.1)* 26(3.0)* 28(3.2)* 31(5.1)* 32(5.0)* 46(2.4)* 63(4.6)*; U9 4(NC)

## Notes on the sheets
sheet 1
- 电机驱动供电
- 电池电源接口
- 蜂鸣器
- 使用有感无刷负压使用，不接5V
- 串口接口
- 5V电源
- 电压测量
- 屏幕接口
- 姿态传感器接口
- 运放电源
- 运放电源
sheet 2
- 无线模块
- 磁铁感应模块
- 运放接口
- 负压有刷接口
- TOF测距模块
- 或使用无感无刷负压使用
- 拨码开关/按键
- 电机信号接口
- 编码器
